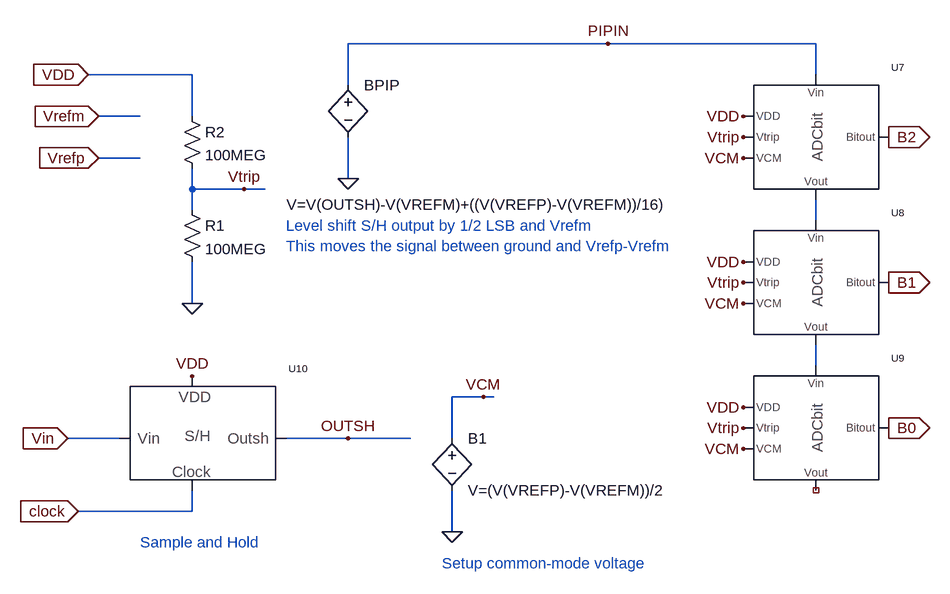
[diagram p0: schematic Ideal_3_bit_ADC.asc]
Ideal_3_bit_ADC.asc, the LTspice schematic file:
Version 4
SHEET 1 2740 696
WIRE 1072 -1104 672 -1104
WIRE 1392 -1104 1072 -1104
WIRE 432 -1056 272 -1056
WIRE 1392 -1056 1392 -1104
WIRE 672 -1040 672 -1104
WIRE 352 -992 288 -992
WIRE 432 -992 432 -1056
WIRE 352 -928 288 -928
WIRE 672 -896 672 -960
WIRE 432 -880 432 -912
WIRE 512 -880 432 -880
WIRE 544 -880 512 -880
WIRE 432 -848 432 -880
WIRE 1392 -832 1392 -864
WIRE 432 -704 432 -768
WIRE 1392 -608 1392 -640
WIRE 880 -560 832 -560
WIRE 896 -560 880 -560
WIRE 320 -496 240 -496
WIRE 672 -496 576 -496
WIRE 768 -496 672 -496
WIRE 832 -496 832 -560
WIRE 432 -384 432 -416
WIRE 432 -384 256 -384
WIRE 832 -352 832 -416
FLAG 256 -384 clock
IOPIN 256 -384 In
FLAG 672 -496 OUTSH
FLAG 512 -880 Vtrip
FLAG 432 -704 0
FLAG 272 -1056 VDD
IOPIN 272 -1056 In
FLAG 240 -496 Vin
IOPIN 240 -496 In
FLAG 832 -352 0
FLAG 880 -560 VCM
FLAG 672 -896 0
FLAG 1280 -960 Vtrip
FLAG 1280 -992 VDD
FLAG 1280 -928 VCM
FLAG 1504 -960 B2
IOPIN 1504 -960 Out
FLAG 1280 -736 Vtrip
FLAG 1280 -768 VDD
FLAG 1280 -704 VCM
FLAG 1504 -736 B1
IOPIN 1504 -736 Out
FLAG 1280 -512 Vtrip
FLAG 1280 -544 VDD
FLAG 1280 -480 VCM
FLAG 1504 -512 B0
IOPIN 1504 -512 Out
FLAG 1072 -1104 PIPIN
FLAG 288 -992 Vrefm
IOPIN 288 -992 In
FLAG 288 -928 Vrefp
IOPIN 288 -928 In
FLAG 432 -592 VDD
SYMBOL res 416 -864 R0
SYMATTR InstName R1
SYMATTR Value 100MEG
SYMBOL res 416 -1008 R0
SYMATTR InstName R2
SYMATTR Value 100MEG
SYMBOL bv 832 -512 R0
SYMATTR InstName B1
SYMATTR Value V=(V(VREFP)-V(VREFM))/2
SYMBOL bv 672 -1056 R0
WINDOW 3 -95 200 Left 0
SYMATTR Value V=V(OUTSH)-V(VREFM)+((V(VREFP)-V(VREFM))/16)
SYMATTR InstName BPIP
SYMBOL ADCbit 1248 -944 R0
SYMATTR InstName U7
SYMBOL ADCbit 1248 -720 R0
SYMATTR InstName U8
SYMBOL ADCbit 1248 -496 R0
SYMATTR InstName U9
SYMBOL Sample_and_hold 336 -432 R0
SYMATTR InstName U10
TEXT 352 -336 Left 0 ;Sample and Hold
TEXT 576 -824 Left 0 ;Level shift S/H output by 1/2 LSB and Vrefm
TEXT 816 -304 Left 0 ;Setup common-mode voltage
TEXT 576 -792 Left 0 ;This moves the signal between ground and Vrefp-Vrefm

The netlist it stands for:
* Ideal_3_bit_ADC.asc
R1 Vtrip 0 100MEG
R2 VDD Vtrip 100MEG
B1 VCM 0 V=(V(VREFP)-V(VREFM))/2
BPIP PIPIN 0 V=V(OUTSH)-V(VREFM)+((V(VREFP)-V(VREFM))/16)
XU7 VDD Vtrip VCM PIPIN B2 N001 ADCbit  ; pins VDD Vtrip VCM Vin Bitout Vout
XU8 VDD Vtrip VCM N001 B1 N002 ADCbit  ; pins VDD Vtrip VCM Vin Bitout Vout
XU9 VDD Vtrip VCM N002 B0 NC_01 ADCbit  ; pins VDD Vtrip VCM Vin Bitout Vout
XU10 Vin OUTSH clock VDD Sample_and_hold  ; pins Vin Outsh Clock VDD
* Sample and Hold
* Level shift S/H output by 1/2 LSB and Vrefm
* Setup common-mode voltage
* This moves the signal between ground and Vrefp-Vrefm
.backanno
.end